# EAGLE design Relay_Breakout (EAGLE 7.7.0)
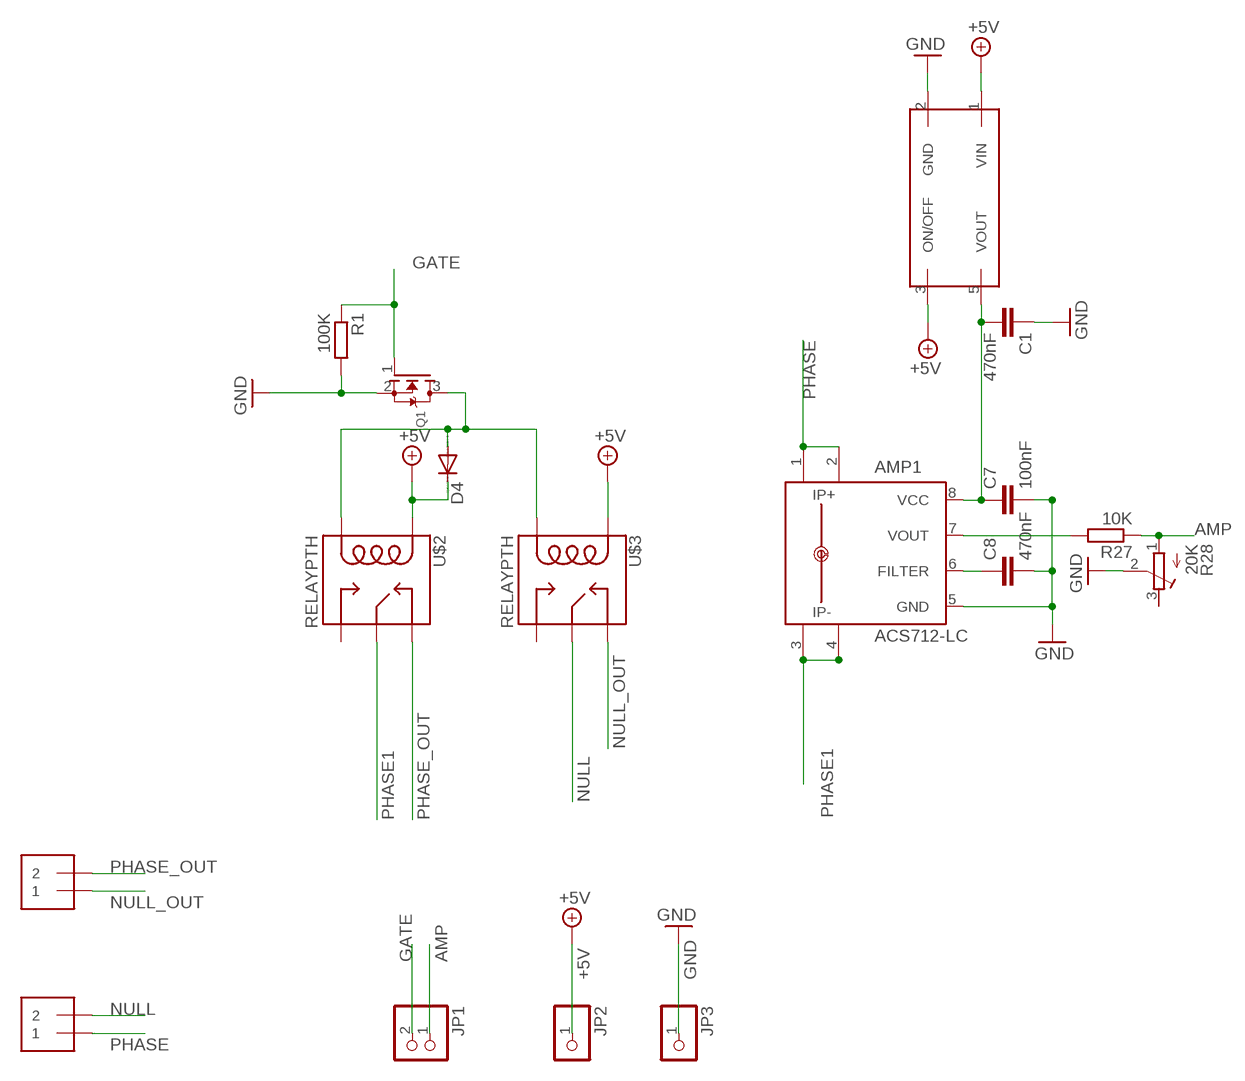
[diagram p0: schematic, sheet 1]

## Parts
4.5V_REG  S1112  [SOT23-5]
AMP1  ACS712-LC  [SOIC8]
C1  470nF  C-EUC0805  [C0805]
C7  100nF  C-EUC0805  [C0805]
C8  470nF  C-EUC0805  [C0805]
D4  DIODE-DO-214AC  [DO-214AC]
J1  1X2-3.5MM  [1X2-3.5MM]
J2  1X2-3.5MM  [1X2-3.5MM]
JP1  PINHD-1X2  [1X02]
JP2  PINHD-1X1  [1X01]
JP3  PINHD-1X1  [1X01]
Q1  MOSFET-NREFLOW  [SOT23]
R1  100K  R-EU_R0805  [R0805]
R27  10K  R-EU_R0805  [R0805]
R28  20K  R-TRIMM5X  [RTRIM5X]
U$2  RELAYPTH  [SRD-05VDC-SL-C]
U$3  RELAYPTH  [SRD-05VDC-SL-C]

## Nets
4.5V: 4.5V_REG.5(VOUT) AMP1.8(VCC) C1.2 C7.1
+5V: 4.5V_REG.1(VIN) 4.5V_REG.3(ON/OFF) D4.C JP2.1 U$2.COIL1 U$3.COIL1
AMP: JP1.1 R27.1 R28.1(A)
GATE: JP1.2 Q1.1(G) R1.1
GND: 4.5V_REG.2(GND) AMP1.5(GND) C1.1 C7.2 C8.2 JP3.1 Q1.2(S) R1.2 R28.2(S)
N$1: D4.A Q1.3(D) U$2.COIL0 U$3.COIL0
N$24: AMP1.6(FILTER) C8.1
N$41: AMP1.7(VOUT) R27.2
NULL: J1.2 U$3.SWCOMMON
NULL_OUT: J2.1 U$3.SWCLOSED(SWCLOSE)
PHASE: AMP1.1(IP+) AMP1.2(IP+1) J1.1
PHASE1: AMP1.3(IP-) AMP1.4(IP-1) U$2.SWCOMMON
PHASE_OUT: J2.2 U$2.SWCLOSED(SWCLOSE)
Unconnected: R28.3(E) U$2.SWOPEN U$3.SWOPEN

## Library data of the parts
4.5V_REG = PowerSocket:S1112
AMP1 = allegro-2:ACS712-LC
C1 C7 C8 = rcl:C-EU: CAPACITOR, European symbol
D4 = diode:DIODE-: DIODE
J1 J2 = adafruit:1X2: 3.5mm Terminal block http://www.ladyada.net/library/pcb/eaglelibrary.html
JP1 = pinhead:PINHD-1X2: PIN HEADER
JP2 JP3 = pinhead:PINHD-1X1: PIN HEADER
Q1 = adafruit:MOSFET-N: N-Channel Mosfet 2N7002E - 60V 260mA SOT23 [Digikey: 2N7002ET1GOSTR-ND] - REEL BSH103 - 30V 850mA SOT23 [Digikey: 568-5013-1-ND]
R1 R27 = rcl:R-EU_: RESISTOR, European symbol
R28 = rcl:R-TRIMM: Trimm resistor
U$2 U$3 = SRD-05VDC-SL-C:RELAY: SPDT relay (COM-00101)

## Board
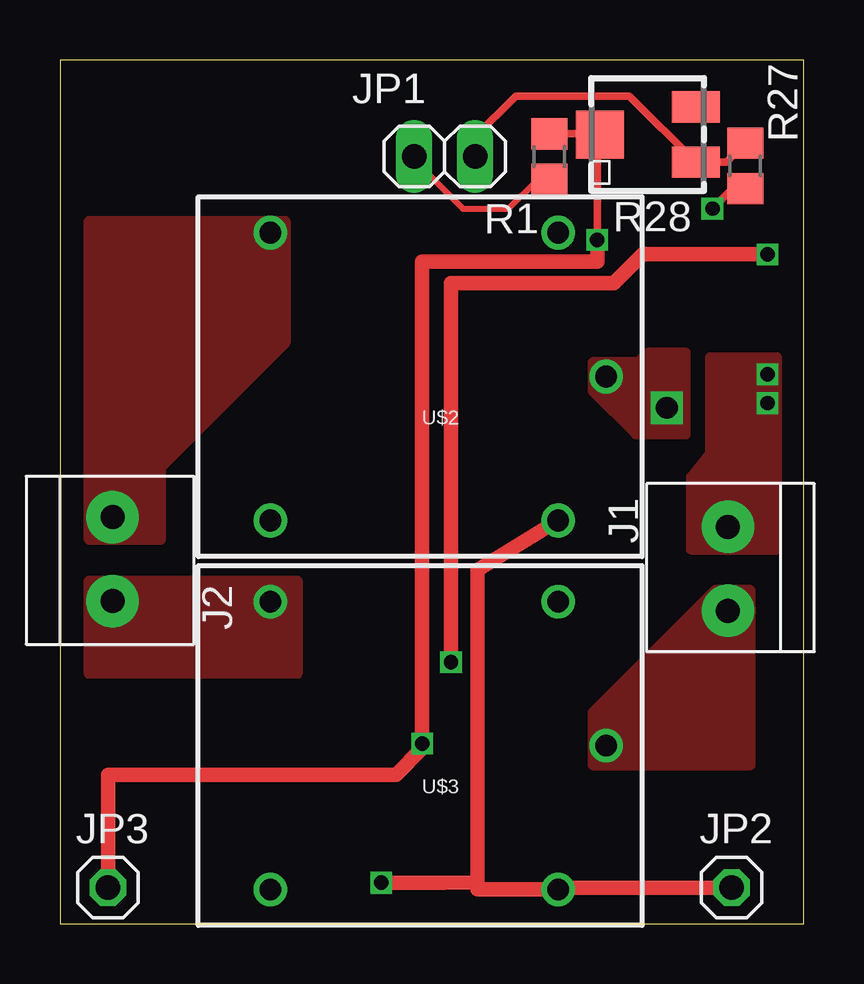
[diagram p1: board, top side]
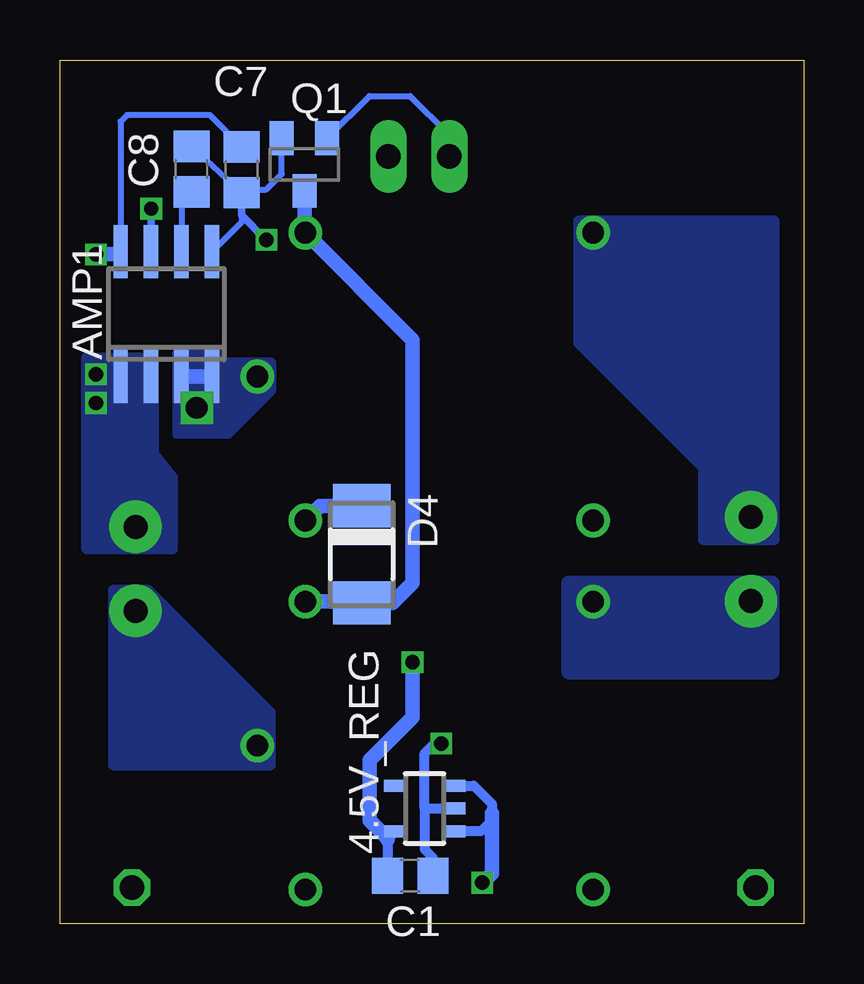
[diagram p2: board, bottom side, seen from below]

Size 31 x 36 mm. Coordinates in mm from the lower left corner, seen from the top.
Outline: 0,0 31,0 31,36 0,36 0,0
Copper layers (1*16): Top 0.035mm / dielectric 1.5mm / Bottom 0.035mm
Design rules "dirt_cheap_dirty_boards.v1": minimum track width 5mil, minimum drill 12mil, track to track 5mil, track to pad 5mil, pad to pad 5mil, via to via 5mil, smd to smd 0mil, copper to edge 10mil, drill to drill 10mil, minimum pad ring 10mil, minimum via ring 6mil, stop-mask expansion 2mil, vias tented up to drill 25mil, thermal gap 10mil

### Footprints (pad centres in the part's own frame; a part is rotated, then mirrored left to right if it is on the bottom)
SOT23-5 = smd 0.5 x 1: 1 -0.95,-1.2; 2 0,-1.2; 3 0.95,-1.2; 4 0.95,1.2; 5 -0.95,1.2
SOIC8 = smd 0.6 x 2.2: 1 -1.905,-2.6; 2 -0.635,-2.6; 3 0.635,-2.6; 4 1.905,-2.6; 5 1.905,2.6; 6 0.635,2.6; 7 -0.635,2.6; 8 -1.905,2.6
C0805 = smd 1.3 x 1.5: 1 -0.95,0; 2 0.95,0
DO-214AC = smd 1.8 x 2.4: A 2.025,0; C -2.025,0
1X2-3.5MM = drill 1 pad 2.184: 1 1.8,0; 2 -1.7,0
1X02 = drill 1.016 long: 1 -1.27,0; 2 1.27,0
1X01 = drill 1.016 octagon: 1 0,0
SOT23 = smd 1 x 1.4: 1 -0.95,-1.1; 2 0.95,-1.1; 3 0,1.1
R0805 = smd 1.3 x 1.5: 1 -0.95,0; 2 0.95,0
RTRIM5X = smd 1.3 x 2: 1 -1.15,-2; 3 1.15,-2 | smd 2 x 2: 2 0,2
SRD-05VDC-SL-C = drill 0.9: COIL0 -5.39,-6.12; COIL1 -5.39,5.88; SWCLOSED 6.61,-6.12; SWCOMMON -7.39,-0.12; SWOPEN 6.61,5.88

### Placement (x,y rotation side)
4.5V_REG  15.8,4.8 90 bottom
AMP1  26.57,25.4 0 bottom
C1  16.4,2 180 bottom
C7  23.42,31.42 270 bottom
C8  25.52,31.45 90 bottom
D4  18.42,15.39 270 bottom
J1  27.85,14.74 90 top
J2  2.19,15.24 270 top
JP1  16.04,31.98 180 top
JP2  28,1.5 0 top
JP3  2,1.5 0 top
Q1  20.81,31.64 180 bottom
R1  20.4,31.97 90 top
R27  28.57,31.58 270 top
R28  24.5,32.89 90 top
U$2  15.38,22.68 180 top
U$3  15.38,7.3 180 top

### Tracks (layer width: path | path; a pad name or v marks a point on that pad's centre or on a via)
4.5V  (via drill 0.6)
  Top 0.61: v16.3,10.9 16.3,26.7 23.1,26.7 24.3,27.9 v29.5,27.9
  Bottom 0.254: C7.1 24.75,33.7 28.2,33.7 28.47,33.43 AMP1.8
  Bottom 0.406: 4.5V_REG.5 17.35,3.5 C1.2
  Bottom 0.61: AMP1.8 28.57,27.9 v29.5,27.9 | 17.35,3.5 17.35,3.55 18.1,4.3 18.1,6.8 16.3,8.6 v16.3,10.9
+5V  (via drill 0.6)
  Top 0.127: U$2.COIL1 20.83,16.83 20.8,16.8
  Top 0.61: JP2.1 20.77,1.5 U$3.COIL1 17.4,1.42 17.4,1.72 | 17.4,1.72 16.02,1.7 v13.4,1.7 | 17.4,1.72 17.4,14.73 U$2.COIL1
  Bottom 0.406: 4.5V_REG.3 13.75,5.75 13,5 13,4.6 13,4.3 13.45,3.85 4.5V_REG.1
  Bottom 0.61: U$2.COIL1 20.16,17.41 D4.C | v13.4,1.7 13,2.1 13,4.6
AMP
  Top 0.305: R27.1 27.78,31.74 R28.1 23.74,34.5 19,34.5 17.31,32.81 JP1.1
GATE
  Top 0.254: 20.4,31 19.9,31 18.7,29.8 16.8,29.8 14.8,31.8 14.77,31.8 JP1.2
  Top 0.61: 20.4,31 R1.1
  Bottom 0.254: Q1.1 18.1,34.5 16.4,34.5 14.8,32.9 14.8,31.9 14.77,31.9 JP1.2
GND  (via drill 0.6)
  Top 0.305: R28.2 22.47,32.92 | 22.47,32.92 R1.2 | 22.47,32.92 22.4,32.85 v22.4,28.5
  Top 0.61: v22.4,28.5 22.4,27.6 15.1,27.6 15.1,7.6 v15.1,7.5 15.1,7.3 14,6.2 2,6.2 JP3.1
  Bottom 0.254: C7.2 C8.2 | C7.2 23.42,29.24 AMP1.5 | C7.2 23.3,30.6 22.4,30.6 21.76,31.24 Q1.2
  Bottom 0.305: v22.4,28.5 23.42,29.52 C7.2
  Bottom 0.406: 15.8,4.8 15.8,7.1 15.4,7.5 v15.1,7.5 | 15.8,4.8 4.5V_REG.2 | 15.8,4.8 15.8,3.1 15.45,2.75 C1.1
N$1
  Bottom 0.254: U$2.COIL0 20.81,28.84
  Bottom 0.61: U$3.COIL0 18.68,13.42 D4.A 17.14,13.37 16.3,14.2 16.3,24.33 U$2.COIL0 | 20.81,28.84 Q1.3
N$24
  Bottom 0.254: C8.1 25.93,30.09 AMP1.6
N$41  (via drill 0.6)
  Top 0.305: v27.2,29.8 28.03,30.63 R27.2
  Bottom 0.305: AMP1.7 v27.2,29.8
NULL
  pour Bottom (no thermals): 27.3,13.9 28.8,13.9 28.8,6.6 22.2,6.6 22.2,8.8
  pour Top (no thermals): 28.8,13.9 27.3,13.9 22.2,8.8 22.2,6.6 28.8,6.6
NULL_OUT
  pour Bottom (no thermals): 1.3,14.2 9.8,14.2 9.8,10.5 1.3,10.5
  pour Top (no thermals): 1.2,14.3 9.9,14.3 9.9,10.4 1.2,10.4
PHASE  (via drill 0.6)
  other vias: 29.5,22.9 29.5,21.7
  pour Bottom (no thermals): 26.3,15.6 29.9,15.6 29.9,23.6 27.1,23.6 27.1,19.6 26.3,18.6
  pour Top (no thermals): 29.9,15.6 29.9,23.6 27.1,23.6 27.1,19.6 26.3,18.6 26.3,15.6
PHASE1  (via drill 0.9)
  Bottom 0.61: AMP1.4 AMP1.3
  other vias: 25.3,21.5
  pour Top (no thermals): 26.1,23.8 24.5,23.8 24.1,23.4 22.2,23.4 22.2,22.2 24,20.4 26.1,20.4
  pour Bottom (no thermals): 26.1,23.8 24.5,23.8 24.1,23.4 22.2,23.4 22.2,22.2 24,20.4 26,20.4 26.1,20.4
PHASE_OUT
  pour Bottom (no thermals): 4.2,16 1.2,16 1.2,29.3 9.4,29.3 9.4,24.2 4.2,19
  pour Top (no thermals): 4.2,16 1.2,16 1.2,29.3 9.4,29.3 9.4,24.2 4.2,19